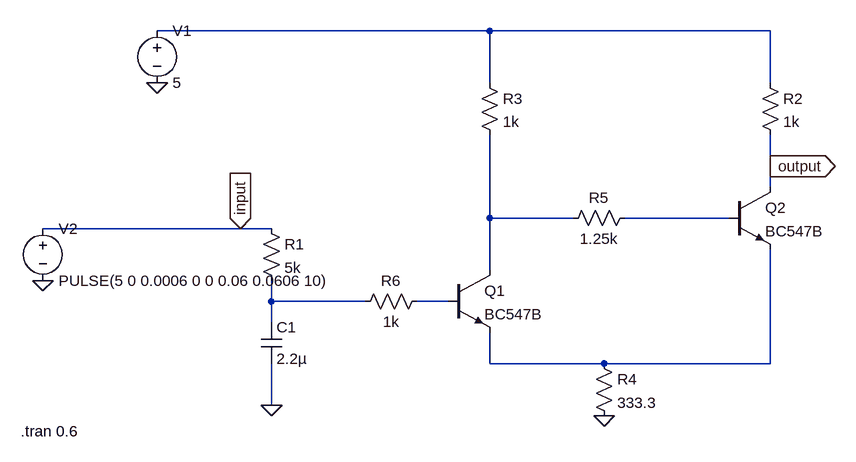
[diagram p0: schematic schmitt_trigger.asc]
schmitt_trigger.asc, the LTspice schematic file:
Version 4
SHEET 1 960 680
WIRE 432 -224 -80 -224
WIRE 864 -224 432 -224
WIRE 432 -144 432 -224
WIRE 864 -144 864 -224
WIRE 864 -16 864 -64
WIRE 864 16 864 -16
WIRE 432 64 432 -64
WIRE 560 64 432 64
WIRE 800 64 640 64
WIRE 48 80 -256 80
WIRE 96 80 48 80
WIRE 432 144 432 64
WIRE 96 192 96 160
WIRE 240 192 96 192
WIRE 368 192 320 192
WIRE 96 224 96 192
WIRE 432 288 432 240
WIRE 608 288 432 288
WIRE 864 288 864 112
WIRE 864 288 608 288
WIRE 96 352 96 288
FLAG 96 352 0
FLAG 608 368 0
FLAG 48 80 input
IOPIN 48 80 In
FLAG 864 -16 output
IOPIN 864 -16 Out
FLAG -80 -144 0
FLAG -256 160 0
SYMBOL res 80 64 R0
SYMATTR InstName R1
SYMATTR Value 5k
SYMBOL cap 80 224 R0
SYMATTR InstName C1
SYMATTR Value 2.2µ
SYMBOL npn 368 144 R0
SYMATTR InstName Q1
SYMATTR Value BC547B
SYMBOL npn 800 16 R0
SYMATTR InstName Q2
SYMATTR Value BC547B
SYMBOL res 848 -160 R0
SYMATTR InstName R2
SYMATTR Value 1k
SYMBOL res 416 -160 R0
SYMATTR InstName R3
SYMATTR Value 1k
SYMBOL res 656 48 R90
WINDOW 0 0 56 VBottom 2
WINDOW 3 32 56 VTop 2
SYMATTR InstName R5
SYMATTR Value 1.25k
SYMBOL voltage -80 -240 R0
WINDOW 123 0 0 Left 0
WINDOW 39 0 0 Left 0
SYMATTR InstName V1
SYMATTR Value 5
SYMBOL res 224 208 R270
WINDOW 0 32 56 VTop 2
WINDOW 3 0 56 VBottom 2
SYMATTR InstName R6
SYMATTR Value 1k
SYMBOL res 592 272 R0
SYMATTR InstName R4
SYMATTR Value 333.3
SYMBOL voltage -256 64 R0
WINDOW 123 0 0 Left 0
WINDOW 39 0 0 Left 0
SYMATTR InstName V2
SYMATTR Value PULSE(5 0 0.0006 0 0 0.06 0.0606 10)
TEXT -290 392 Left 2 !.tran 0.6

The netlist it stands for:
* schmitt_trigger.asc
R1 input N004 5k
C1 N004 0 2.2µ
Q1 N002 N005 N006 0 BC547B
Q2 output N003 N006 0 BC547B
R2 N001 output 1k
R3 N001 N002 1k
R5 N003 N002 1.25k
V1 N001 0 5
R6 N004 N005 1k
R4 N006 0 333.3
V2 input 0 PULSE(5 0 0.0006 0 0 0.06 0.0606 10)
.model NPN NPN
.model PNP PNP
.lib standard.bjt
.tran 0.6
.backanno
.end